# EAGLE schematic PMB (EAGLE 6.6.0)
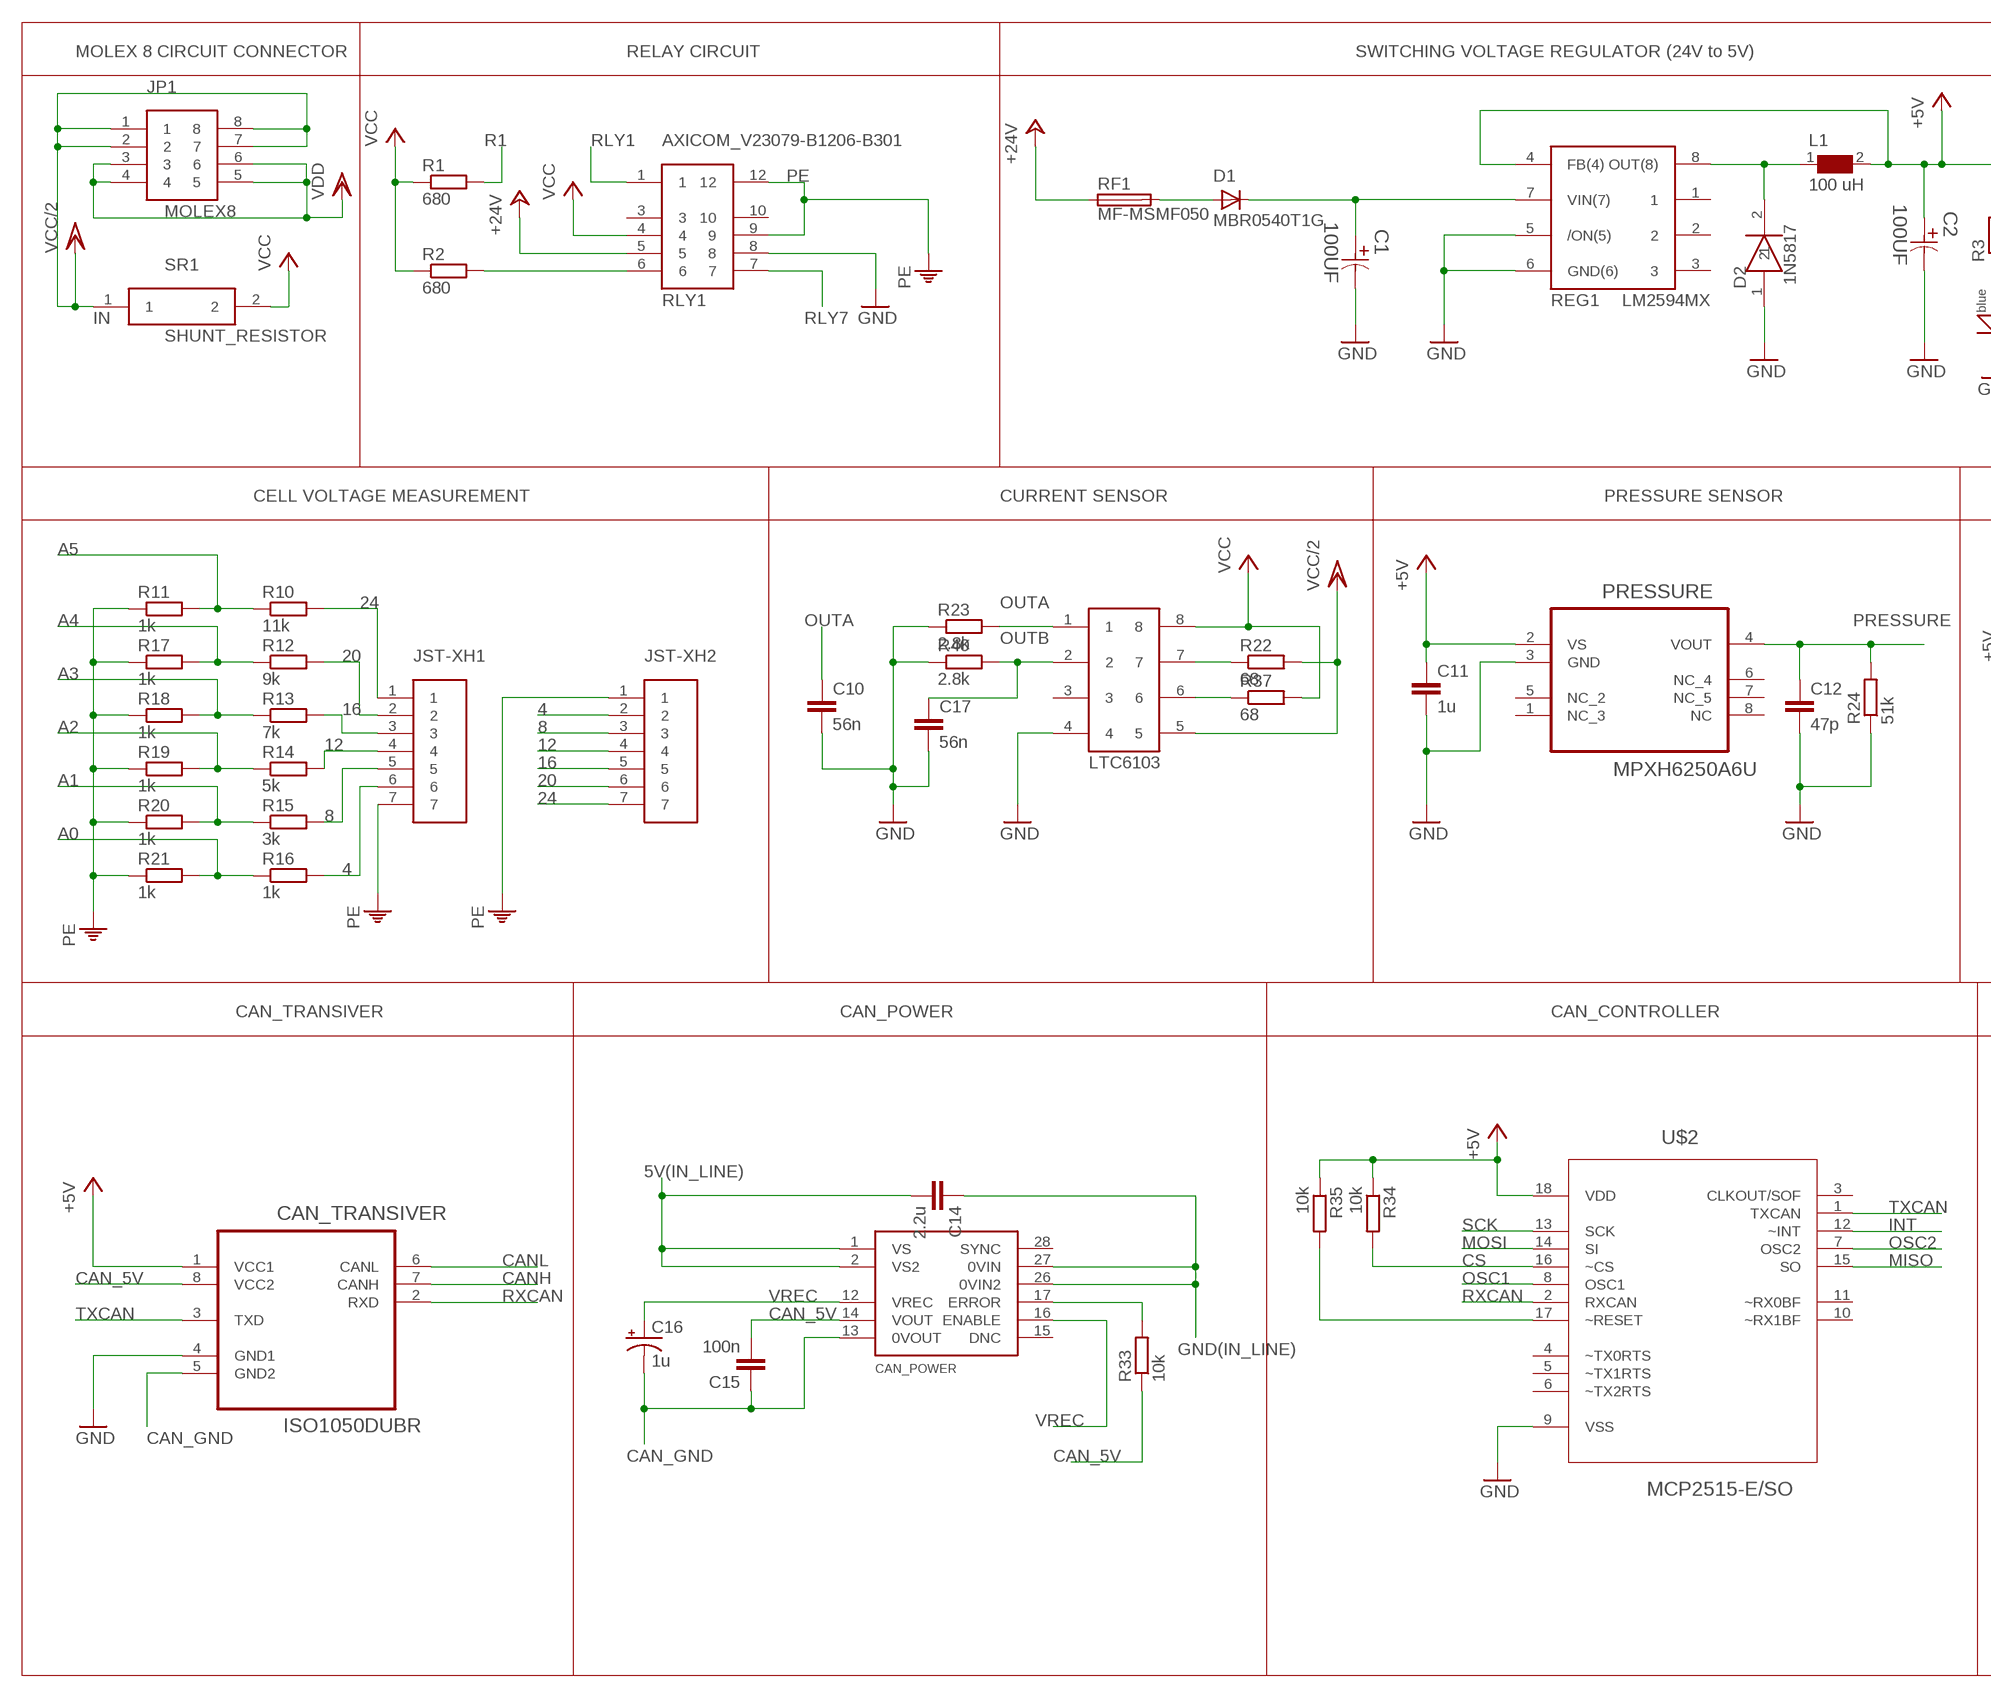
[diagram p0: schematic, sheet 1, part 1 of 2]
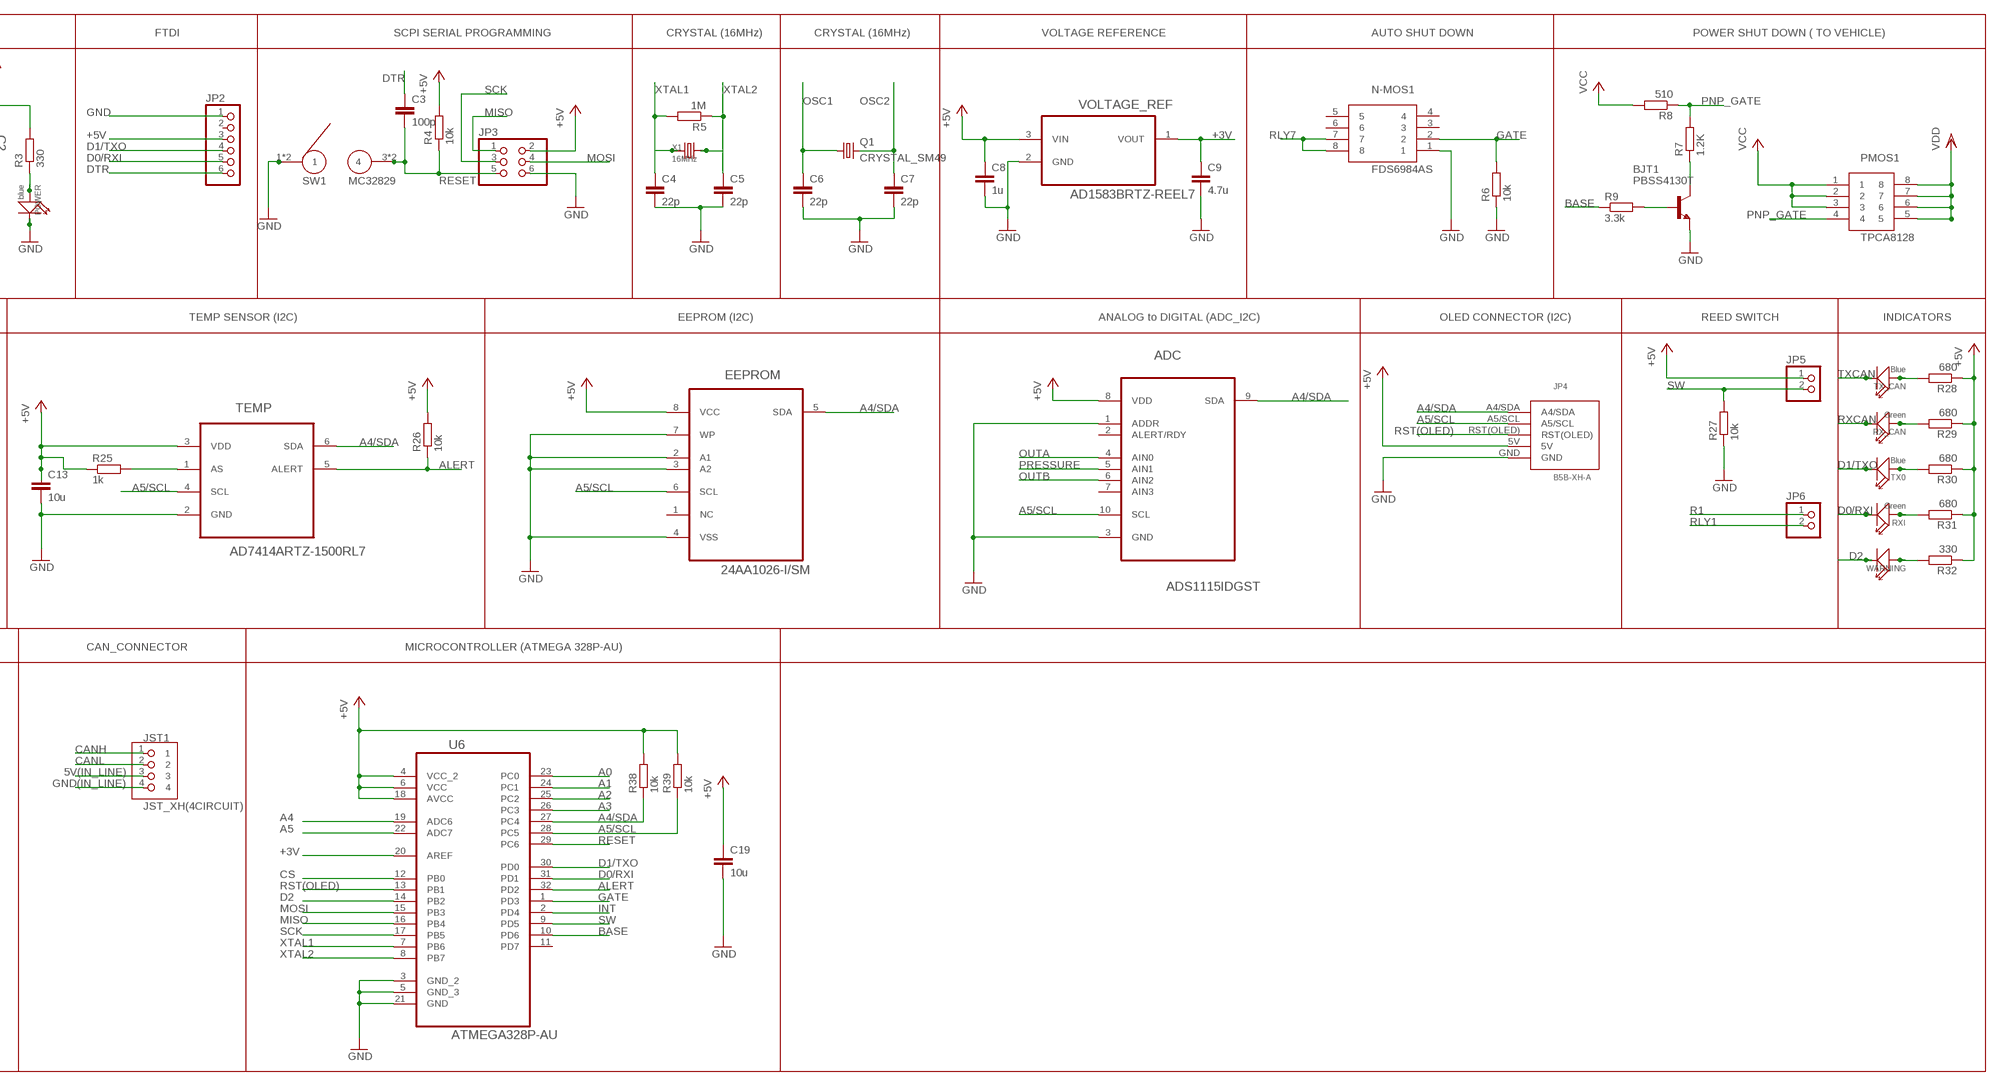
[diagram p1: schematic, sheet 1, part 2 of 2]

## Parts
ADC  ADS1115IDGST  [SOP50P490X110-10N]
BJT1  PBSS4130T  [SOT-23]
C1  100UF  EEE-FTV151XAP-CASE-D8  [CAPAE660X800N]
C2  100UF  EEE-FTV151XAP-CASE-D8  [CAPAE660X800N]
C3  100p  CAP0805  [0805]
C4  22p  CAP0805  [0805]
C5  22p  CAP0805  [0805]
C6  22p  CAP0805  [0805]
C7  22p  CAP0805  [0805]
C8  1u  CAP0805  [0805]
C9  4.7u  CAP0805  [0805]
C10  56n  CAP0805  [0805]
C11  1u  CAP0805  [0805]
C12  47p  CAP0805  [0805]
C13  10u  CAP0805  [0805]
C14  2.2u  CAP0603-CAP  [0603-CAP]
C15  100n  1UF-25V-10%(0805)  [0805]
C16  1u  CAP_POL6032  [EIA6032]
C17  56n  CAP0805  [0805]
C19  10u  CAP0805  [0805]
CAN_POWER  DCR01SO  [DCR01-SOIC28]
CAN_TRANSIVER  ISO1050DUBR  [SOIC254P1040X485-8N]
D1  MBR0540T1G  [MBR0540T1G]
D2  1N5817  [1N5817]
EEPROM  24AA1026-I/SM  [SOIC127P794X200-8N]
JP1  MOLEX8  [026013144]
JP2  PINHD-1X6/90  [1X06/90]
JP3  PINHD-2X3  [2X03]
JP4  B5B-XH-A  [B5B-XH-A]
JP5  PINHD-1X2/90  [1X02/90]
JP6  PINHD-1X2/90  [1X02/90]
JST1  JST_XH(4CIRCUIT)  [JXT-XHP-4]
JST-XH1  JST_XH_1X7_2.5MM  [SIL_1X8_2.5MM]
JST-XH2  JST_XH_1X7_2.5MM  [SIL_1X8_2.5MM]
L1  100 uH  WE-PD-7447714101_1030/1050  [WE-PD_1030/1050]
LTC1  LTC6103  [LTC6103]
N-MOS1  FDS6984AS  [SO-8]
PMOS1  TPCA8128  [TPCA8128]
POWER  blue  LED-0805  [LED-0805]
PRESSURE  MPXH6250A6U  [FREESCALE_CASE_1317]
Q1  CRYSTAL_SM49  [SM49]
R1  680  R-EU_R0805W  [R0805W]
R2  680  R-EU_R0805W  [R0805W]
R3  330  R-EU_R0805W  [R0805W]
R4  10k  R-EU_R0805W  [R0805W]
R5  1M  R-EU_R0805W  [R0805W]
R6  10k  R-EU_R0805W  [R0805W]
R7  1.2K  R-EU_R0805W  [R0805W]
R8  510  R-EU_R0805W  [R0805W]
R9  3.3k  R-EU_R0805W  [R0805W]
R10  11k  R-EU_R0805W  [R0805W]
R11  1k  R-EU_R0805W  [R0805W]
R12  9k  R-EU_R0805W  [R0805W]
R13  7k  R-EU_R0805W  [R0805W]
R14  5k  R-EU_R0805W  [R0805W]
R15  3k  R-EU_R0805W  [R0805W]
R16  1k  R-EU_R0805W  [R0805W]
R17  1k  R-EU_R0805W  [R0805W]
R18  1k  R-EU_R0805W  [R0805W]
R19  1k  R-EU_R0805W  [R0805W]
R20  1k  R-EU_R0805W  [R0805W]
R21  1k  R-EU_R0805W  [R0805W]
R22  68  R-EU_R0805W  [R0805W]
R23  2.8k  R-EU_R0805W  [R0805W]
R24  51k  R-EU_R0805W  [R0805W]
R25  1k  R-EU_R0805W  [R0805W]
R26  10k  R-EU_R0805W  [R0805W]
R27  10k  R-EU_R0805W  [R0805W]
R28  680  R-EU_R0805W  [R0805W]
R29  680  R-EU_R0805W  [R0805W]
R30  680  R-EU_R0805W  [R0805W]
R31  680  R-EU_R0805W  [R0805W]
R32  330  R-EU_R0805W  [R0805W]
R33  10k  R-EU_R0805W  [R0805W]
R34  10k  R-EU_R0805W  [R0805W]
R35  10k  R-EU_R0805W  [R0805W]
R37  68  R-EU_R0805W  [R0805W]
R38  10k  R-EU_R0805W  [R0805W]
R39  10k  R-EU_R0805W  [R0805W]
R40  2.8k  R-EU_R0805W  [R0805W]
REG1  LM2594MX  [LM2594MX]
RF1  MF-MSMF050  [MF-MSF050]
RLY1  AXICOM_V23079-B1206-B301  [RELAY_V23079_B1206]
RX_CAN  Green  LED-0805  [LED-0805]
RXI  Green  LED-0805  [LED-0805]
SR1  SHUNT_RESISTOR  [OARSXPR002FLF]
SW1  MC32829  [MC32829]
TEMP  AD7414ARTZ-1500RL7  [SOT95P280X145-6N]
TX0  Blue  LED-0805  [LED-0805]
TX_CAN  Blue  LED-0805  [LED-0805]
U6  ATMEGA328P-AU  [QFP80P900X900X120-32N]
U$2  MCP2515-E/SO  [SOIC127P1030X265-18N]
VOLTAGE_REF  AD1583BRTZ-REEL7  [SOT95P237X112-3N]
WARNING  LED-0805  [LED-0805]
X1  16MHz  CRYSTAL  [HC49US]

## Nets
4: JST-XH1.6 JST-XH2.2 R16.2
5V(IN_LINE): C14.2 CAN_POWER.1(VS) CAN_POWER.2(VS2) JST1.3
8: JST-XH1.5 JST-XH2.3 R15.2
12: JST-XH1.4 JST-XH2.4 R14.2
16: JST-XH1.3 JST-XH2.5 R13.2
20: JST-XH1.2 JST-XH2.6 R12.2
24: JST-XH1.1 JST-XH2.7 R10.2
+3V: C9.1 U6.20(AREF) VOLTAGE_REF.1(VOUT)
+5V: ADC.8(VDD) C2.1 C8.1 C11.1 C13.1 C19.1 CAN_TRANSIVER.1(VCC1) EEPROM.8(VCC) JP2.3 JP3.2 JP4.5V JP5.1 L1.2 PRESSURE.2(VS) R3.2 R4.2 R25.1 R26.2 R28.1 R29.1 R30.1 R31.1 R32.1 R34.1 R35.1 R38.2 R39.2 REG1.4(FB(4)) TEMP.3(VDD) U6.4(VCC_2) U6.6(VCC) U6.18(AVCC) U$2.18(VDD) VOLTAGE_REF.3(VIN)
+24V: RF1.1 RLY1.5
A0: R16.1 R21.2 U6.23(PC0)
A1: R15.1 R20.2 U6.24(PC1)
A2: R14.1 R19.2 U6.25(PC2)
A3: R13.1 R18.2 U6.26(PC3)
A4: R12.1 R17.2 U6.19(ADC6)
A4/SDA: ADC.9(SDA) EEPROM.5(SDA) JP4.A4/SDA R38.1 TEMP.6(SDA) U6.27(PC4)
A5: R10.1 R11.2 U6.22(ADC7)
A5/SCL: ADC.10(SCL) EEPROM.6(SCL) JP4.A5/SCL R39.1 TEMP.4(SCL) U6.28(PC5)
ALERT: R26.1 TEMP.5(ALERT) U6.32(PD2)
BASE: R9.1 U6.10(PD6)
CAN_5V: C15.2 CAN_POWER.14(VOUT) CAN_TRANSIVER.8(VCC2) R33.1
CAN_GND: C15.1 C16.P$2(-) CAN_POWER.13(0VOUT) CAN_TRANSIVER.5(GND2)
CANH: CAN_TRANSIVER.7(CANH) JST1.1
CANL: CAN_TRANSIVER.6(CANL) JST1.2
CS: R34.2 U6.12(PB0) U$2.16(~CS)
D0/RXI: JP2.5 RXI.- U6.31(PD1)
D1/TXO: JP2.4 TX0.- U6.30(PD0)
D2: U6.14(PB2) WARNING.-
DTR: C3.1 JP2.6
GATE: N-MOS1.2 R6.2 U6.1(PD3)
GND: ADC.1(ADDR) ADC.3(GND) BJT1.E C1.2 C2.2 C4.2 C5.2 C6.2 C7.2 C8.2 C9.2 C10.2 C11.2 C12.2 C13.2 C17.2 C19.2 CAN_TRANSIVER.4(GND1) D2.1 EEPROM.2(A1) EEPROM.3(A2) EEPROM.4(VSS) EEPROM.7(WP) JP2.1 JP3.6 JP4.GND LTC1.4 N-MOS1.1 POWER.- PRESSURE.3(GND) R6.1 R23.1 R24.1 R27.1 R40.1 REG1.5(/ON(5)) REG1.6(GND(6)) RLY1.8 SW1.1 SW1.2 TEMP.2(GND) U6.3(GND_2) U6.5(GND_3) U6.21(GND) U$2.9(VSS) VOLTAGE_REF.2(GND)
GND(IN_LINE): C14.1 CAN_POWER.26(0VIN2) CAN_POWER.27(0VIN) JST1.4
INT: U6.2(PD4) U$2.12(~INT)
MISO: JP3.1 U6.16(PB4) U$2.15(SO)
MOSI: JP3.4 U6.15(PB3) U$2.14(SI)
N$1: BJT1.B R9.2
N$2: D1.2 RF1.2
N$3: C1.1 D1.1 REG1.7(VIN(7))
N$4: R2.2 RLY1.6
N$5: D2.2 L1.1 REG1.8(OUT(8))
N$6: BJT1.C R7.1
N$7: POWER.+ R3.1
N$8: LTC1.7 R22.1
N$9: R25.2 TEMP.1(AS)
N$10: R32.2 WARNING.+
N$11: R31.2 RXI.+
N$12: R30.2 TX0.+
N$13: R29.2 RX_CAN.+
N$14: R28.2 TX_CAN.+
N$15: LTC1.6 R37.1
N$21: CAN_POWER.17(ERROR) R33.2
N$24: R35.2 U$2.17(~RESET)
OSC1: C6.1 Q1.1 U$2.8(OSC1)
OSC2: C7.1 Q1.2 U$2.7(OSC2)
OUTA: ADC.4(AIN0) C10.1 LTC1.1 R23.2
OUTB: ADC.6(AIN2) C17.1 LTC1.2 R40.2
PE: JST-XH1.7 JST-XH2.1 R11.1 R17.1 R18.1 R19.1 R20.1 R21.1 RLY1.9 RLY1.12
PNP_GATE: PMOS1.4 R7.2 R8.1
PRESSURE: ADC.5(AIN1) C12.1 PRESSURE.4(VOUT) R24.2
R1: JP6.1 R1.2
RESET: C3.2 JP3.5 R4.1 SW1.3 SW1.4 U6.29(PC6)
RLY1: JP6.2 RLY1.1
RLY7: N-MOS1.7 N-MOS1.8 RLY1.7
RST(OLED): JP4.RST(OLED) U6.13(PB1)
RXCAN: CAN_TRANSIVER.2(RXD) RX_CAN.- U$2.2(RXCAN)
SCK: JP3.3 U6.17(PB5) U$2.13(SCK)
SW: JP5.2 R27.2 U6.9(PD5)
TXCAN: CAN_TRANSIVER.3(TXD) TX_CAN.- U$2.1(TXCAN)
VCC: LTC1.8 PMOS1.1 PMOS1.2 PMOS1.3 R1.1 R2.1 R8.2 R37.2 RLY1.4 SR1.2
VCC/2: JP1.1 JP1.2 JP1.7 JP1.8 LTC1.5 R22.2 SR1.1
VDD: JP1.3 JP1.4 JP1.5 JP1.6 PMOS1.5 PMOS1.6 PMOS1.7 PMOS1.8
VREC: C16.P$1(+) CAN_POWER.12(VREC) CAN_POWER.16(ENABLE)
XTAL1: C4.1 R5.2 U6.7(PB6) X1.1
XTAL2: C5.1 R5.1 U6.8(PB7) X1.2
Unconnected: ADC.2(ALERT/RDY) ADC.7(AIN3) CAN_POWER.15(DNC) CAN_POWER.28(SYNC) EEPROM.1(NC) JP2.2 LTC1.3 N-MOS1.3 N-MOS1.4 N-MOS1.5 N-MOS1.6 PRESSURE.1(NC_3) PRESSURE.5(NC_2) PRESSURE.6(NC_4) PRESSURE.7(NC_5) PRESSURE.8(NC) REG1.1 REG1.2 REG1.3 RLY1.3 RLY1.10 U6.11(PD7) U$2.3(CLKOUT/SOF) U$2.4(~TX0RTS) U$2.5(~TX1RTS) U$2.6(~TX2RTS) U$2.10(~RX1BF) U$2.11(~RX0BF)

## Notes on the sheet
- MOLEX 8 CIRCUIT CONNECTOR | RELAY CIRCUIT | SWITCHING VOLTAGE REGULATOR (24V to 5V) | FTDI | SCPI SERIAL PROGRAMMING | CRYSTAL (16MHz) | CRYSTAL (16MHz) | VOLTAGE REFERENCE | AUTO SHUT DOWN | POWER SHUT DOWN ( TO VEHICLE)
- IN
- CELL VOLTAGE MEASUREMENT | CURRENT SENSOR | PRESSURE SENSOR | TEMP SENSOR (I2C) | EEPROM (I2C) | ANALOG to DIGITAL (ADC_I2C) | OLED CONNECTOR (I2C) | REED SWITCH | INDICATORS
- CAN_TRANSIVER | CAN_POWER | CAN_CONTROLLER | CAN_CONNECTOR | MICROCONTROLLER (ATMEGA 328P-AU)

## Library data of the parts
ADC = ADS1115:ADS1115IDGST: Analog-to-Digital Converter with Internal Reference; MPN: ADS1115IDGST; OC_FARNELL: 1762981; OC_NEWARK: 25R1241; PACKAGE: MSOP-10; SUPPLIER: Texas Instruments
BJT1 = NPN:PBSS4130T
C1 C2 = Panasonic-EEEFT_EEEH:EEE-: Aluminum Electrolytic Capacitors,Surface Mount Type; MPN: EEE-FTV151XAP; OC_FARNELL: 1868418; OC_NEWARK: 31T8173; PACKAGE: CASE-D8; SUPPLIER: PANASONIC; TOLERANCE: ±20 %; VALUE: 150UF; VOLTAGERATING: 35V
C3-C13 C17 C19 = SparkFun-Capacitors:CAP: Capacitor Standard 0603 ceramic capacitor, and 0.1" leaded capacitor.
C14 = SparkFun-Passives:CAP: Capacitor Standard 0603 ceramic capacitor, and 0.1" leaded capacitor.
C15 = SparkFun-Capacitors:1UF-25V-10%(0805): CAP-08064; PROD_ID: CAP-08064; VALUE: 1uF
C16 = SparkFun-Passives:CAP_POL: Capacitor Polarized These are standard SMD and PTH capacitors. Normally 10uF, 47uF, and 100uF in electrolytic and tantalum varieties. Always verify the external diameter of the through hole cap, it varies with capacity, voltage, and manufacturer. The EIA devices should be standard.
CAN_POWER = bbauv:DCR01: The DCR01 family is a series of high-efficiency, input-isolated, output-regulated DC/DC converters. In addition to 1W nominal, galvanically-isolated output power capability, this range of DC/DCs offer very low output noise, thermal protection, and high accuracy. The DCR01 family is implemented in standard molded IC packaging, giving standard JEDEC outlines suitable for high-volume assembly. The DCR01 is manufactured using the same technology as standard IC packages, thereby achieving very high reliability.
CAN_TRANSIVER = CAN-Controller-Library:ISO1050DUBR: ISOLATED CAN TRANSCEIVER; MPN: ISO1050DUBR; OC_FARNELL: 2118645; OC_NEWARK: 14R9899; PACKAGE: DIP-8; SUPPLIER: TEXAS INSTRUMENTS
D1 = Power_diode:MBR0540T1G
D2 = diode:1N5817
EEPROM = eeprom:24AA1026-I/SM: Serial EEPROM,SOIC-8; MPN: 24AA1026-I/SM; OC_FARNELL: 1971893; OC_NEWARK: 59T0229; PACKAGE: SOIC-8; SUPPLIER: MICROCHIP
JP1 = molex8:MOLEX8
JP2 = pinhead:PINHD-1X6: PIN HEADER
JP3 = pinhead:PINHD-2X3: PIN HEADER
JP4 = jst-xh(5circuit):B5B-XH-A
JP5 JP6 = pinhead:PINHD-1X2: PIN HEADER
JST1 = jst-xh(4circuit):JST_XH(4CIRCUIT)
JST-XH1 JST-XH2 = SIL_1X8_2.5MM:JST_XH_1X7_2.5MM
L1 = WE-PD:WE-PD: SMD-Shielded Power Inductors WE-PD - Magnetically shielded version which results in a low leakage field - High storage capacity - Low self-losses - Highest possible current loading for SMD-Inducors -- Switching regulators with low operating voltages (computer, laptop, mobile phones, pagers) -- Integrated DC/DC-converter -- Is recommended for the application with switching regulators from National Semiconductor, Linear Technology, Texas Instruments and Fairchild Semiconductor, ect. -- Graphic cards -- Plastic base: Because of the one piece construction these are more suitable for high vibration or shock applications; MPN: 7447714101; OC_FARNELL: 2082677; OC_NEWARK: 88T7105; PACKAGE: 1050; SUPPLIER: Wuerth Elektronik
LTC1 = LTC6103:LTC6103
N-MOS1 = dual_n-mosfet:FDS6984AS
PMOS1 = p-mosfet:TPCA8128
POWER RX_CAN RXI TX0 TX_CAN WARNING = Discrete:LED
PRESSURE = pressure_sensor:MPXH6250A6U: SENSOR, PRESSURE, 20-250KPA, CASE 1317; MPN: MPXH6250A6U; OC_FARNELL: 2238140; OC_NEWARK: 47W3656; PACKAGE: CASE 1317; SUPPLIER: FREESCALE SEMICONDUCTOR
Q1 = crystal(16Mhz):CRYSTAL_SM49
R1-R35 R37-R40 = resistor:R-EU_: RESISTOR, European symbol
REG1 = lm2594:LM2594MX
RF1 = Resetable_fuse:MF-MSMF050
RLY1 = AXICOM_V23079_B1206:AXICOM_V23079-B1206-B301
SR1 = oarsxpr002flf:SHUNT_RESISTOR
SW1 = mc32829(pb_sw):MC32829
TEMP = pressure_sensor(AD7414):AD7414ARTZ-1500RL7: ±0.5°C Accurate, 10-Bit Digital Temperature Sensors; MPN: AD7414ARTZ-1500RL7; OC_FARNELL: 1699530; OC_NEWARK: 12M8805; PACKAGE: SOT-23-6; SUPPLIER: Analog Devices
U6 = atmel-atmega328p-au:ATMEGA328P-AU: 8-bit Microcontroller with In-System Programmable Flash; MPN: ATMEGA328P-AU; OC_FARNELL: 1715486; OC_NEWARK: 14R4631; PACKAGE: TQFP-32; SUPPLIER: Atmel
U$2 = CAN-Controller-Library:MCP2515-E/SO: Stand-Alone CAN Controller; DESCRIPTION: IC CAN CONTROLLER; MPN: MCP2515-E/SO; OC_FARNELL: 1605565; OC_NEWARK: 29H7134; PACKAGE: SOIC-18; SUPPLIER: Microchip
VOLTAGE_REF = AD1583:AD1583BRTZ-REEL7: Series Mode Voltage References; MPN: AD1583BRTZ-Reel7; OC_FARNELL: 2074900; OC_NEWARK: 59K3394; PACKAGE: SOT23-3; SUPPLIER: Analog Devices
X1 = Discrete:CRYSTAL*